# Altium schematic sheet Chess_Clock.SchDoc
size 420 x 297 mm; SheetNumber: 1; SheetTotal: 1
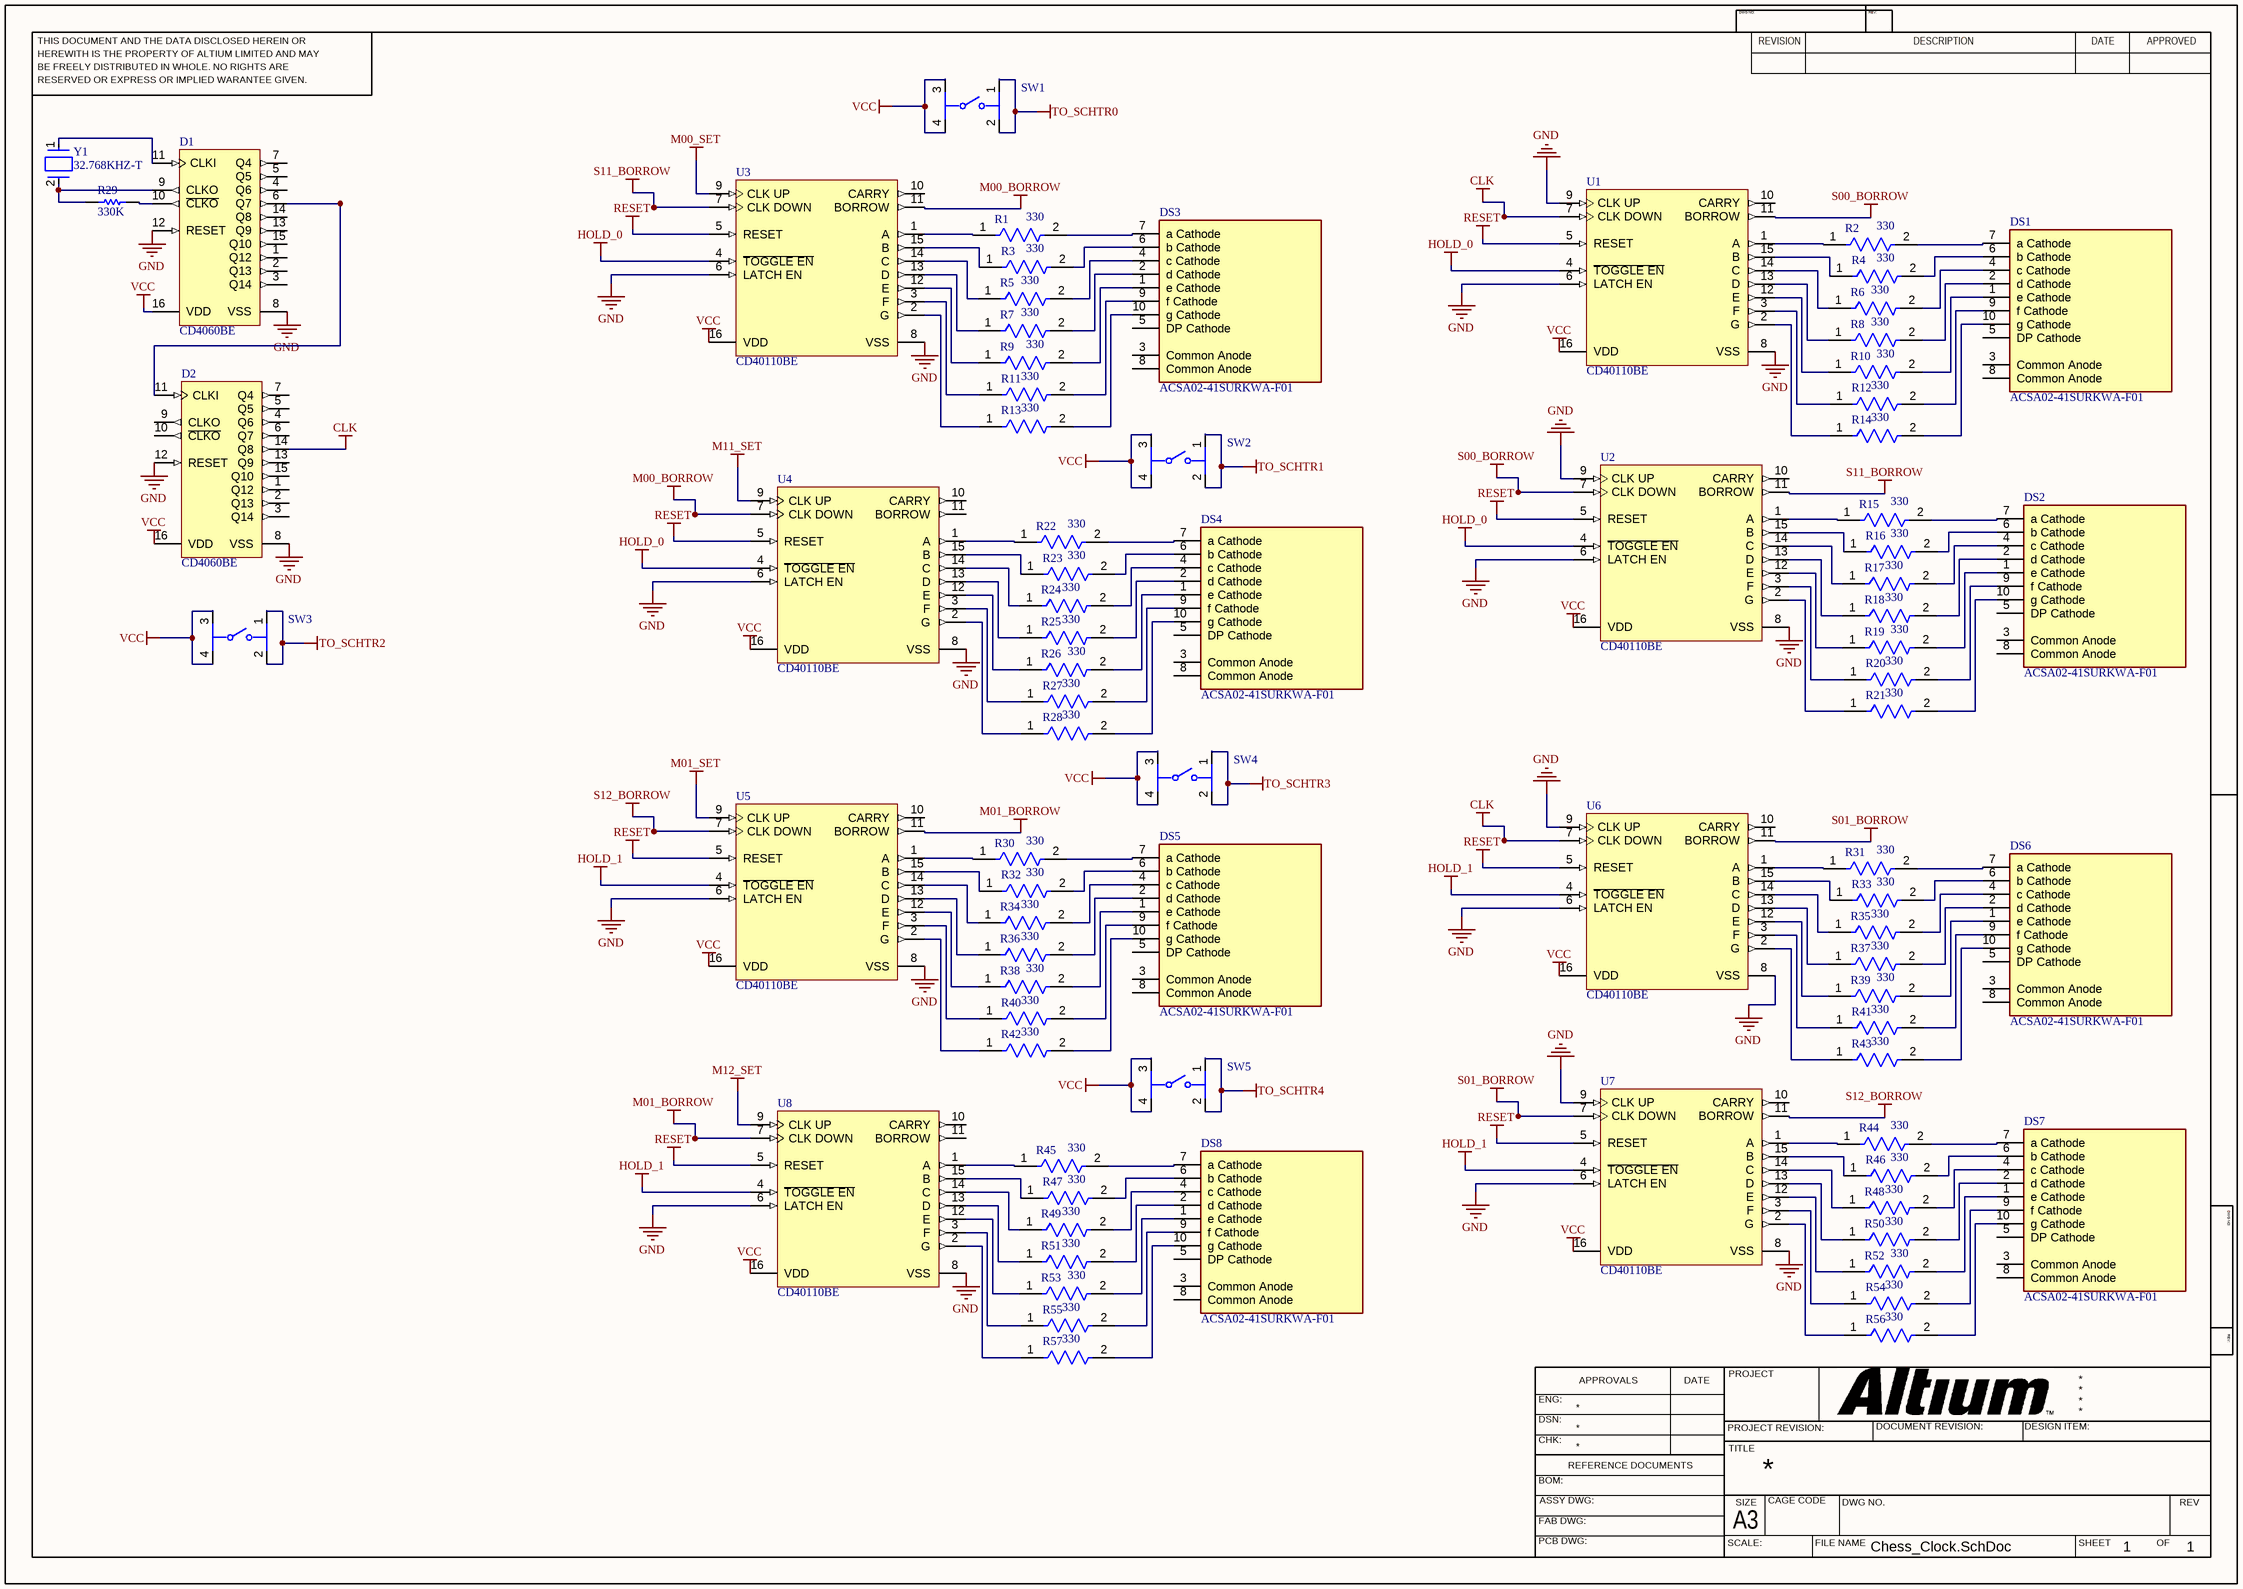
[diagram p0: Chess_Clock.SchDoc]

## Parts
D1  CD4060BE  [N0016A]
D2  CD4060BE  [N0016A]
DS1  ACSA02-41SURKWA-F01  [FP-ACSA02-41SURKWA-F01-MFG]
DS2  ACSA02-41SURKWA-F01  [FP-ACSA02-41SURKWA-F01-MFG]
DS3  ACSA02-41SURKWA-F01  [FP-ACSA02-41SURKWA-F01-MFG]
DS4  ACSA02-41SURKWA-F01  [FP-ACSA02-41SURKWA-F01-MFG]
DS5  ACSA02-41SURKWA-F01  [FP-ACSA02-41SURKWA-F01-MFG]
DS6  ACSA02-41SURKWA-F01  [FP-ACSA02-41SURKWA-F01-MFG]
DS7  ACSA02-41SURKWA-F01  [FP-ACSA02-41SURKWA-F01-MFG]
DS8  ACSA02-41SURKWA-F01  [FP-ACSA02-41SURKWA-F01-MFG]
R1  330  [FP-CRCW0603-e3-MFG]
R2  330  [FP-CRCW0603-e3-MFG]
R3  330  [FP-CRCW0603-e3-MFG]
R4  330  [FP-CRCW0603-e3-MFG]
R5  330  [FP-CRCW0603-e3-MFG]
R6  330  [FP-CRCW0603-e3-MFG]
R7  330  [FP-CRCW0603-e3-MFG]
R8  330  [FP-CRCW0603-e3-MFG]
R9  330  [FP-CRCW0603-e3-MFG]
R10  330  [FP-CRCW0603-e3-MFG]
R11  330  [FP-CRCW0603-e3-MFG]
R12  330  [FP-CRCW0603-e3-MFG]
R13  330  [FP-CRCW0603-e3-MFG]
R14  330  [FP-CRCW0603-e3-MFG]
R15  330  [FP-CRCW0603-e3-MFG]
R16  330  [FP-CRCW0603-e3-MFG]
R17  330  [FP-CRCW0603-e3-MFG]
R18  330  [FP-CRCW0603-e3-MFG]
R19  330  [FP-CRCW0603-e3-MFG]
R20  330  [FP-CRCW0603-e3-MFG]
R21  330  [FP-CRCW0603-e3-MFG]
R22  330  [FP-CRCW0603-e3-MFG]
R23  330  [FP-CRCW0603-e3-MFG]
R24  330  [FP-CRCW0603-e3-MFG]
R25  330  [FP-CRCW0603-e3-MFG]
R26  330  [FP-CRCW0603-e3-MFG]
R27  330  [FP-CRCW0603-e3-MFG]
R28  330  [FP-CRCW0603-e3-MFG]
R29  330K  [RESC1609X50X30NL8T20]
R30  330  [FP-CRCW0603-e3-MFG]
R31  330  [FP-CRCW0603-e3-MFG]
R32  330  [FP-CRCW0603-e3-MFG]
R33  330  [FP-CRCW0603-e3-MFG]
R34  330  [FP-CRCW0603-e3-MFG]
R35  330  [FP-CRCW0603-e3-MFG]
R36  330  [FP-CRCW0603-e3-MFG]
R37  330  [FP-CRCW0603-e3-MFG]
R38  330  [FP-CRCW0603-e3-MFG]
R39  330  [FP-CRCW0603-e3-MFG]
R40  330  [FP-CRCW0603-e3-MFG]
R41  330  [FP-CRCW0603-e3-MFG]
R42  330  [FP-CRCW0603-e3-MFG]
R43  330  [FP-CRCW0603-e3-MFG]
R44  330  [FP-CRCW0603-e3-MFG]
R45  330  [FP-CRCW0603-e3-MFG]
R46  330  [FP-CRCW0603-e3-MFG]
R47  330  [FP-CRCW0603-e3-MFG]
R48  330  [FP-CRCW0603-e3-MFG]
R49  330  [FP-CRCW0603-e3-MFG]
R50  330  [FP-CRCW0603-e3-MFG]
R51  330  [FP-CRCW0603-e3-MFG]
R52  330  [FP-CRCW0603-e3-MFG]
R53  330  [FP-CRCW0603-e3-MFG]
R54  330  [FP-CRCW0603-e3-MFG]
R55  330  [FP-CRCW0603-e3-MFG]
R56  330  [FP-CRCW0603-e3-MFG]
R57  330  [FP-CRCW0603-e3-MFG]
SW1  (no value)  [FP-PTS645SM43SMTR92LFS-MFG]
SW2  (no value)  [FP-PTS645SM43SMTR92LFS-MFG]
SW3  (no value)  [FP-PTS645SM43SMTR92LFS-MFG]
SW4  (no value)  [FP-PTS645SM43SMTR92LFS-MFG]
SW5  (no value)  [FP-PTS645SM43SMTR92LFS-MFG]
U1  CD40110BE  [N0016A]
U2  CD40110BE  [N0016A]
U3  CD40110BE  [N0016A]
U4  CD40110BE  [N0016A]
U5  CD40110BE  [N0016A]
U6  CD40110BE  [N0016A]
U7  CD40110BE  [N0016A]
U8  CD40110BE  [N0016A]
Y1  32.768KHZ-T  [FP-AB26TRB-MFG]

## Nets
CLK: D2.14(Q8) U1.7(CLK_DOWN) U6.7(CLK_DOWN)
GND: D1.8(VSS) D1.12(RESET) D2.8(VSS) D2.12(RESET) U1.6(LATCH_EN) U1.8(VSS) U1.9(CLK_UP) U2.6(LATCH_EN) U2.8(VSS) U2.9(CLK_UP) U3.6(LATCH_EN) U3.8(VSS) U4.6(LATCH_EN) U4.8(VSS) U5.6(LATCH_EN) U5.8(VSS) U6.6(LATCH_EN) U6.8(VSS) U6.9(CLK_UP) U7.6(LATCH_EN) U7.8(VSS) U7.9(CLK_UP) U8.6(LATCH_EN) U8.8(VSS)
HOLD_0: U1.4(~{TOGGLE_EN}) U2.4(~{TOGGLE_EN}) U3.4(~{TOGGLE_EN}) U4.4(~{TOGGLE_EN})
HOLD_1: U5.4(~{TOGGLE_EN}) U6.4(~{TOGGLE_EN}) U7.4(~{TOGGLE_EN}) U8.4(~{TOGGLE_EN})
M00_BORROW: U3.11(BORROW) U4.7(CLK_DOWN)
M00_SET: U3.9(CLK_UP)
M01_BORROW: U5.11(BORROW) U8.7(CLK_DOWN)
M01_SET: U5.9(CLK_UP)
M11_SET: U4.9(CLK_UP)
M12_SET: U8.9(CLK_UP)
RESET: U1.5(RESET) U2.5(RESET) U3.5(RESET) U4.5(RESET) U5.5(RESET) U6.5(RESET) U7.5(RESET) U8.5(RESET)
S00_BORROW: U1.11(BORROW) U2.7(CLK_DOWN)
S01_BORROW: U6.11(BORROW) U7.7(CLK_DOWN)
S11_BORROW: U2.11(BORROW) U3.7(CLK_DOWN)
S12_BORROW: U5.7(CLK_DOWN) U7.11(BORROW)
TO_SCHTR0: SW1.1 SW1.2
TO_SCHTR1: SW2.1 SW2.2
TO_SCHTR2: SW3.1 SW3.2
TO_SCHTR3: SW4.1 SW4.2
TO_SCHTR4: SW5.1 SW5.2
VCC: D1.16(VDD) D2.16(VDD) SW1.3 SW1.4 SW2.3 SW2.4 SW3.3 SW3.4 SW4.3 SW4.4 SW5.3 SW5.4 U1.16(VDD) U2.16(VDD) U3.16(VDD) U4.16(VDD) U5.16(VDD) U6.16(VDD) U7.16(VDD) U8.16(VDD)
NetD1_6: D1.6(Q7) D2.11(CLKI)
NetD1_9: D1.9(CLKO) R29.1 Y1.2
NetD1_10: D1.10(~{CLKO}) R29.2
NetD1_11: D1.11(CLKI) Y1.1
NetDS1_1: DS1.1(e_Cathode) R10.2
NetDS1_2: DS1.2(d_Cathode) R8.2
NetDS1_4: DS1.4(c_Cathode) R6.2
NetDS1_6: DS1.6(b_Cathode) R4.2
NetDS1_7: DS1.7(a_Cathode) R2.2
NetDS1_9: DS1.9(f_Cathode) R12.2
NetDS1_10: DS1.10(g_Cathode) R14.2
NetDS2_1: DS2.1(e_Cathode) R19.2
NetDS2_2: DS2.2(d_Cathode) R18.2
NetDS2_4: DS2.4(c_Cathode) R17.2
NetDS2_6: DS2.6(b_Cathode) R16.2
NetDS2_7: DS2.7(a_Cathode) R15.2
NetDS2_9: DS2.9(f_Cathode) R20.2
NetDS2_10: DS2.10(g_Cathode) R21.2
NetDS3_1: DS3.1(e_Cathode) R9.2
NetDS3_2: DS3.2(d_Cathode) R7.2
NetDS3_4: DS3.4(c_Cathode) R5.2
NetDS3_6: DS3.6(b_Cathode) R3.2
NetDS3_7: DS3.7(a_Cathode) R1.2
NetDS3_9: DS3.9(f_Cathode) R11.2
NetDS3_10: DS3.10(g_Cathode) R13.2
NetDS4_1: DS4.1(e_Cathode) R26.2
NetDS4_2: DS4.2(d_Cathode) R25.2
NetDS4_4: DS4.4(c_Cathode) R24.2
NetDS4_6: DS4.6(b_Cathode) R23.2
NetDS4_7: DS4.7(a_Cathode) R22.2
NetDS4_9: DS4.9(f_Cathode) R27.2
NetDS4_10: DS4.10(g_Cathode) R28.2
NetDS5_1: DS5.1(e_Cathode) R38.2
NetDS5_2: DS5.2(d_Cathode) R36.2
NetDS5_4: DS5.4(c_Cathode) R34.2
NetDS5_6: DS5.6(b_Cathode) R32.2
NetDS5_7: DS5.7(a_Cathode) R30.2
NetDS5_9: DS5.9(f_Cathode) R40.2
NetDS5_10: DS5.10(g_Cathode) R42.2
NetDS6_1: DS6.1(e_Cathode) R39.2
NetDS6_2: DS6.2(d_Cathode) R37.2
NetDS6_4: DS6.4(c_Cathode) R35.2
NetDS6_6: DS6.6(b_Cathode) R33.2
NetDS6_7: DS6.7(a_Cathode) R31.2
NetDS6_9: DS6.9(f_Cathode) R41.2
NetDS6_10: DS6.10(g_Cathode) R43.2
NetDS7_1: DS7.1(e_Cathode) R52.2
NetDS7_2: DS7.2(d_Cathode) R50.2
NetDS7_4: DS7.4(c_Cathode) R48.2
NetDS7_6: DS7.6(b_Cathode) R46.2
NetDS7_7: DS7.7(a_Cathode) R44.2
NetDS7_9: DS7.9(f_Cathode) R54.2
NetDS7_10: DS7.10(g_Cathode) R56.2
NetDS8_1: DS8.1(e_Cathode) R53.2
NetDS8_2: DS8.2(d_Cathode) R51.2
NetDS8_4: DS8.4(c_Cathode) R49.2
NetDS8_6: DS8.6(b_Cathode) R47.2
NetDS8_7: DS8.7(a_Cathode) R45.2
NetDS8_9: DS8.9(f_Cathode) R55.2
NetDS8_10: DS8.10(g_Cathode) R57.2
NetR1_1: R1.1 U3.1(A)
NetR2_1: R2.1 U1.1(A)
NetR3_1: R3.1 U3.15(B)
NetR4_1: R4.1 U1.15(B)
NetR5_1: R5.1 U3.14(C)
NetR6_1: R6.1 U1.14(C)
NetR7_1: R7.1 U3.13(D)
NetR8_1: R8.1 U1.13(D)
NetR9_1: R9.1 U3.12(E)
NetR10_1: R10.1 U1.12(E)
NetR11_1: R11.1 U3.3(F)
NetR12_1: R12.1 U1.3(F)
NetR13_1: R13.1 U3.2(G)
NetR14_1: R14.1 U1.2(G)
NetR15_1: R15.1 U2.1(A)
NetR16_1: R16.1 U2.15(B)
NetR17_1: R17.1 U2.14(C)
NetR18_1: R18.1 U2.13(D)
NetR19_1: R19.1 U2.12(E)
NetR20_1: R20.1 U2.3(F)
NetR21_1: R21.1 U2.2(G)
NetR22_1: R22.1 U4.1(A)
NetR23_1: R23.1 U4.15(B)
NetR24_1: R24.1 U4.14(C)
NetR25_1: R25.1 U4.13(D)
NetR26_1: R26.1 U4.12(E)
NetR27_1: R27.1 U4.3(F)
NetR28_1: R28.1 U4.2(G)
NetR30_1: R30.1 U5.1(A)
NetR31_1: R31.1 U6.1(A)
NetR32_1: R32.1 U5.15(B)
NetR33_1: R33.1 U6.15(B)
NetR34_1: R34.1 U5.14(C)
NetR35_1: R35.1 U6.14(C)
NetR36_1: R36.1 U5.13(D)
NetR37_1: R37.1 U6.13(D)
NetR38_1: R38.1 U5.12(E)
NetR39_1: R39.1 U6.12(E)
NetR40_1: R40.1 U5.3(F)
NetR41_1: R41.1 U6.3(F)
NetR42_1: R42.1 U5.2(G)
NetR43_1: R43.1 U6.2(G)
NetR44_1: R44.1 U7.1(A)
NetR45_1: R45.1 U8.1(A)
NetR46_1: R46.1 U7.15(B)
NetR47_1: R47.1 U8.15(B)
NetR48_1: R48.1 U7.14(C)
NetR49_1: R49.1 U8.14(C)
NetR50_1: R50.1 U7.13(D)
NetR51_1: R51.1 U8.13(D)
NetR52_1: R52.1 U7.12(E)
NetR53_1: R53.1 U8.12(E)
NetR54_1: R54.1 U7.3(F)
NetR55_1: R55.1 U8.3(F)
NetR56_1: R56.1 U7.2(G)
NetR57_1: R57.1 U8.2(G)

Not connected (* = marked no-connect by the designer): D1 1(Q12) 2(Q13) 3(Q14) 4(Q6) 5(Q5) 7(Q4) 13(Q9) 14(Q8) 15(Q10); D2 1(Q12) 2(Q13) 3(Q14) 4(Q6) 5(Q5) 6(Q7) 7(Q4) 9(CLKO) 10(~{CLKO}) 13(Q9) 15(Q10); DS1 3(Common_Anode) 5(DP_Cathode) 8(Common_Anode); DS2 3(Common_Anode) 5(DP_Cathode) 8(Common_Anode); DS3 3(Common_Anode) 5(DP_Cathode) 8(Common_Anode); DS4 3(Common_Anode) 5(DP_Cathode) 8(Common_Anode); DS5 3(Common_Anode) 5(DP_Cathode) 8(Common_Anode); DS6 3(Common_Anode) 5(DP_Cathode) 8(Common_Anode); DS7 3(Common_Anode) 5(DP_Cathode) 8(Common_Anode); DS8 3(Common_Anode) 5(DP_Cathode) 8(Common_Anode); U1 10(CARRY); U2 10(CARRY); U3 10(CARRY); U4 10(CARRY) 11(BORROW); U5 10(CARRY); U6 10(CARRY); U7 10(CARRY); U8 10(CARRY) 11(BORROW)

## Notes on the sheet
- THIS DOCUMENT AND THE DATA DISCLOSED HEREIN OR
- HEREWITH IS THE PROPERTY OF ALTIUM LIMITED AND MAY
- DWG NO:
- REVISION
- REV:
- DESCRIPTION
- DATE
- APPROVED
- BE FREELY DISTRIBUTED IN WHOLE. NO RIGHTS ARE
- RESERVED OR EXPRESS OR IMPLIED WARANTEE GIVEN.
- ENG:
- APPROVALS
- PROJECT
- DSN:
- CHK:
- REFERENCE DOCUMENTS
- PROJECT REVISION:
- TITLE
- DOCUMENT REVISION:
- DESIGN ITEM:
- BOM:
- FAB DWG:
- PCB DWG:
- ASSY DWG:
- SCALE:
- A3
- SIZE
- CAGE CODE
- FILE NAME
- DWG NO.
- SHEET
- OF
- REV

## Library data of the parts
D1 D2 = CMP-1086-00011-4: CMOS 14-Stage Ripple Carry Binary Counter / Divider and Oscillator, 3 to 18 V, -55 to 125 degC, 16-Pin PDIP (N), RoHS, Tube; Manufacturer: Texas Instruments; tPHL, tPLH (typ) @ 5 V: 370 ns; VDD: 3 to 18 V; PackageDescription: 16-Pin Plastic Dual In-Line Package, Body 19.305 x 6.35 mm, Pitch 2.54 mm; ComponentLink1URL: http://www.ti.com; ComponentLink3Description: Package Specification; DatasheetVersion: SCHS049C; PackageVersion: 4040049/E; Packing: Tube; ComponentLink2Description: Datasheet; Mounting Technology: Through Hole; ComponentLink2URL: http://www.ti.com/lit/ds/symlink/cd4060b.pdf; ComponentLink3URL: http://www.ti.com/lit/ml/mpdi002c/mpdi002c.pdf; Temperature Range: -55 to 125 degC; PackageReference: N0016A; ComponentLink1Description: Manufacturer URL; RoHS: TRUE; PartNumber: CD4060BE
DS1-DS8 = CMP-44525-000003-1: DISPLAY 7-SEG 0.2" SGL RED 10SMD; Element Configuration: Common Anode; Forward Current: 30mA; Wavelength: 630nm; Operating Supply Voltage: 1.95V; Number of Characters: 1; Max Power Dissipation: 75mW; Luminous Intensity: 30mcd; Test Current: 20mA; Package Quantity: 650; Width: 0.272inch; Max Operating Temperature: 85°C; Case/Package: SMD/SMT; Illumination Color: Red; Min Operating Temperature: -40°C; Packaging: Tape and Reel; Power Consumption: 75mW; Forward Voltage: 1.95V; Color: Red; Height: 0.315inch
R1-R28 R30-R57 = CMP-1012-00454-3: RES Thick Film, 330Ω, 1%, 0.1W, 100ppm/°C, 0603; Voltage Rating: 75V; Max Power Dissipation: 100mW; Resistance: 330R; Depth: 0.85mm; Contact Plating: Tin; Package Quantity: 10; Termination: SMD/SMT; Tolerance: 1%; Height: 0.45mm; Number of Terminations: 2; Radiation Hardening: No; Features: Automotive AEC-Q200; Case/Package: 0603; Mount: Surface Mount; Case Code (Metric): 1608; Lead Free: Lead Free; Temperature Coefficient: 100ppm/°C; Weight: 7.1E-05oz; Military Standard: Not; Packaging: Tape and Reel; Max Operating Temperature: 155°C; Voltage Rating (DC): 75V; Length: 1.55mm; Min Operating Temperature: -55°C; Composition: Thick Film; Case Code (Imperial): 0603; Width: 0.033inch; Power Rating: 100mW
R29 = CMP-2000-03816-5: Chip Resistor, 0 Ohm, Jumper, 100 mW, -55 to 155 degC, 0603 (1608 Metric), RoHS, Tape and Reel; Manufacturer: Vishay Semiconductor; Voltage Rating: 75 V; Package Quantity: 5000; DatasheetVersion: 06/2012; Min Operating Temperature: -55 degC; ComponentLink1URL: http://www.vishay.com/; Mounting Technology: Surface Mount; Height: 0.45 mm; ComponentLink1Description: Manufacturer URL; REACH SVHC: Unknown; PackageReference: 0603; Packaging: Tape and Reel; Max Operating Temperature: 155 degC; Mount: Surface Mount; ComponentLink2Description: Datasheet; PackageDescription: 2-Pin Surface Mount Device, Body 1.575 x 0.85 mm; Length: 1.55 mm; ComponentLink2URL: http://www.vishay.com/docs/20035/dcrcwe3.pdf; Pins: 2; RoHSCompliant: true
SW1-SW5 = CMP-2000-05160-2: SWITCH TACTILE SPST-NO 0.05A 12V; Contact Resistance: 100mR; Throw Configuration: SPST; Illumination Type: Non-Illuminated; Mechanical Life: 100000Cycles; Current Rating: 50mA; Switch Function: Off-Mom; Actuator Length: 0.85mm; Actuator Material: Nylon; Actuator Type: Standard; Operating Force: 160gf; Min Operating Temperature: -20°C; REACH SVHC: No SVHC; Termination: Gull Wing; Case/Package: SMD/SMT; Packaging: Tape and Reel; Mount: Surface Mount; Voltage Rating (DC): 12V; Orientation: Straight; Lead Free: Lead Free; Contact Material: Silver; Color: Black; Max Current Rating: 50mA; Contact Plating: Silver; Depth: 9mm; Package Quantity: 1; Max Voltage Rating (DC): 12V; Length: 6mm; Max Operating Temperature: 60°C
U1-U8 = CMP-1623-00539-2: CMOS Decade Up-Down Counter/Latch/Display Driver, N0016A, TUBE; Manufacturer: Texas Instruments; Technology Family: CD4000; Rating: Catalog; VCC(Max)(V): 18; Voltage(Nom)(V): 5,10,15; F @ Nom Voltage(Max)(Mhz): 8; Output Drive (IOL/IOH)(Max)(mA): 1.5/-1.5; Schmitt Trigger: No; VCC(Min)(V): 3; Bits(#): 7; tpd @ Nom Voltage(Max)(ns): 720; Inputs: 1; ICC @ Nom Voltage(Max)(mA): 0.03; Code_JEDEC: MS-001; Input Type: CMOS; PackageReference: N0016A; Generic Part Number: CD40110B; DatasheetVersion: SCHS100; Operating Temperature Range(C): -55 to 125; Output Type: CMOS; Type: Decade; Function: Counter
Y1 = CMP-27762-006068-1: CRYSTAL 32.7680KHZ 12.5PF TH; Frequency Stability: -0.034ppm; Frequency Tolerance: 20ppm; Series Resistance: 50kR; Case/Package: Radial; Package Quantity: 500; Packaging: Tape and Reel; Lead Pitch: 2.54mm; Termination: Radial; Mount: Surface Mount; Frequency: 32.768kHz; Min Operating Temperature: -40°C; REACH SVHC: No SVHC; Load Capacitance: 12.5pF; Lead Free: Lead Free; Operating Frequency: 32.768 kHz; Max Operating Temperature: 85°C; Length: 6mm; Height: 0.075inch; Depth: 1.9mm; Tolerance: 20ppm; ESR (Equivalent Series Resistance): 50kR; Number of Pins: 2; Series: AB26TRB